# EasyEDA schematic Task10.1PCB.json
TITLE: Sheet_1; REV: 1.0; Date: 2020-06-05; Sheet: 1/1; Drawn By: smhamza; Company: Your Company
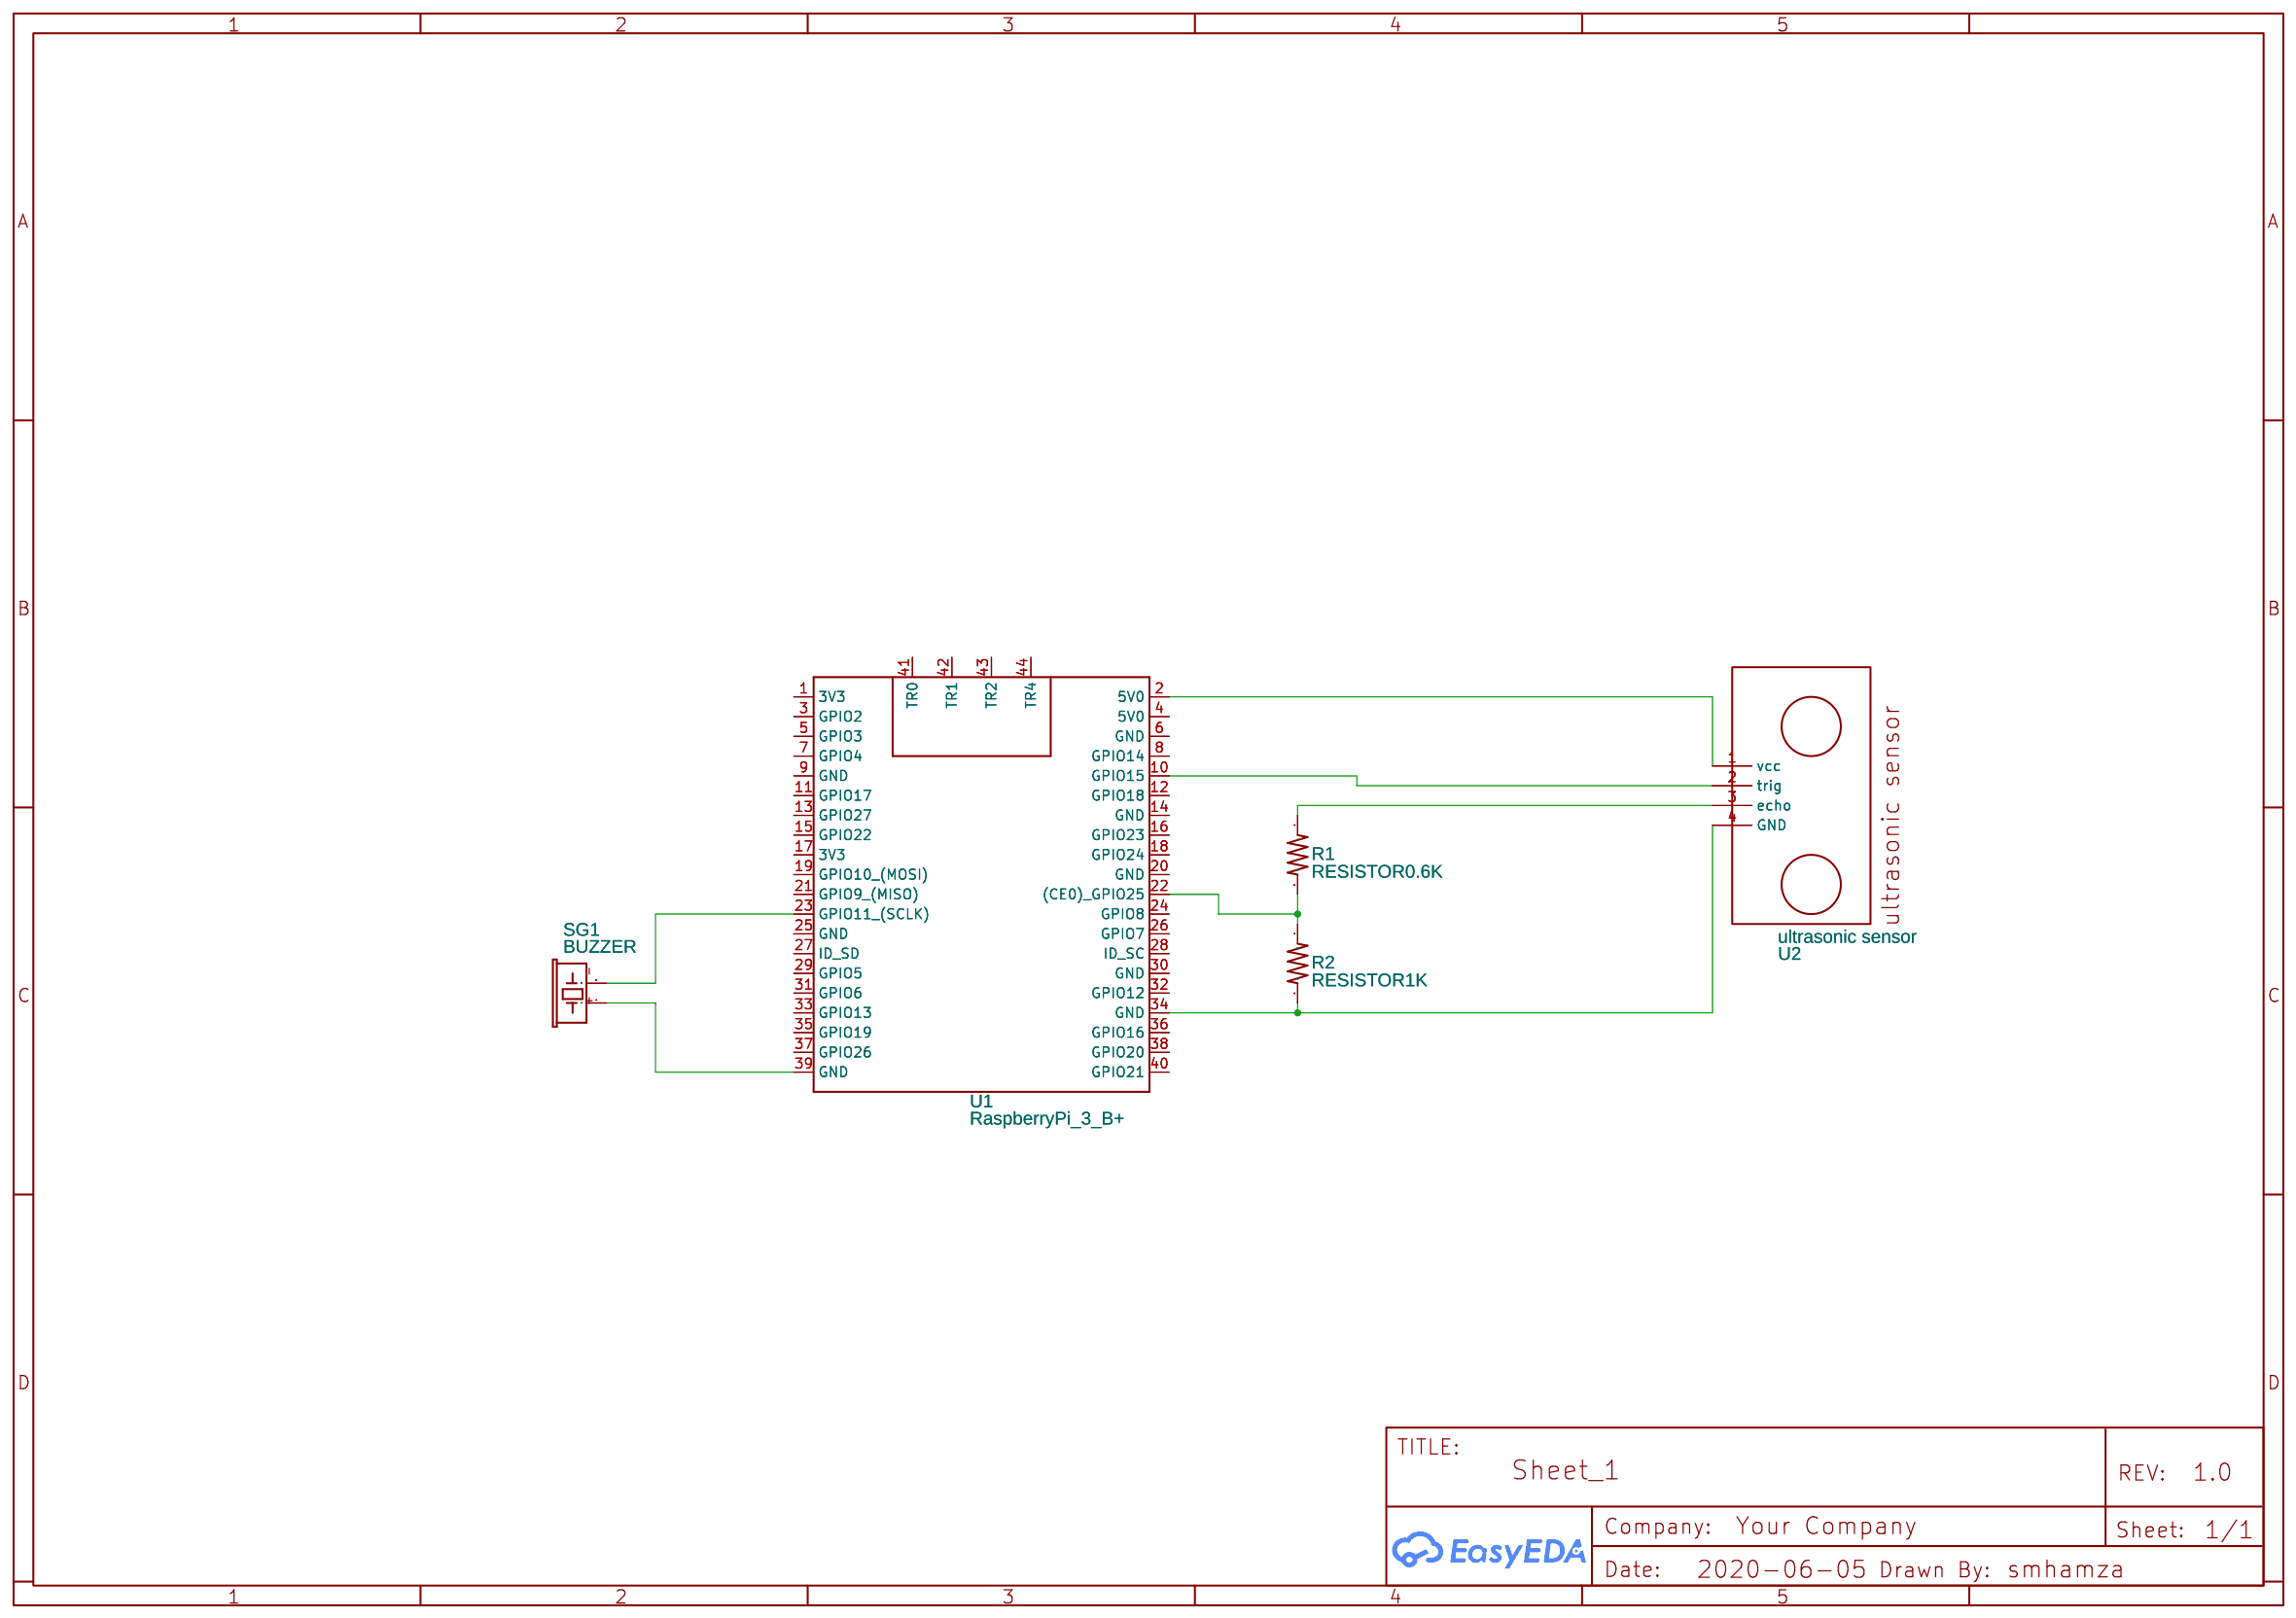
[diagram p0: schematic sheet]

## Parts
R1  RESISTOR0.6K  [VISH-RES-0603]
R2  RESISTOR1K  [VISH-RES-0603]
SG1  BUZZER  [BUZZER-HOFFMANN]
U1  RaspberryPi_3_B+  [RASBERRYPI_3_B+_POE]
U2  ultrasonic sensor  [ULTRASONIC SENSOR]

## Library data of the parts
R1 R2 = RESISTOR1K: Contributor: Time God
SG1 = BUZZER: Contributor: SparkFun
U1 = RaspberryPi_3_B+: Manufacturer Part: RaspberryPi 3; Contributor: sebasiano
U2 = ultrasonic sensor: Supplier: LCSC; Contributor: Aksen

## Nets
Net-(R1-1): R1.1 U2.3(echo)
Net-(R1-2): R1.2 R2.1 U1.22((CE0) GPIO25)
Net-(R2-2): R2.2 U1.34(GND) U2.4(GND)
Net-(SG1-1): SG1.1 U1.39(GND)
Net-(SG1-2): SG1.2 U1.23(GPIO11 (SCLK))
Net-(U1-2): U1.2(5V0) U2.1(vcc)
Net-(U1-10): U1.10(GPIO15) U2.2(trig)

Not connected (* = marked no-connect by the designer): U1 1(3V3) 3(GPIO2) 4(5V0) 5(GPIO3) 6(GND) 7(GPIO4) 8(GPIO14) 9(GND) 11(GPIO17) 12(GPIO18) 13(GPIO27) 14(GND) 15(GPIO22) 16(GPIO23) 17(3V3) 18(GPIO24) 19(GPIO10 (MOSI)) 20(GND) 21(GPIO9 (MISO)) 24(GPIO8) 25(GND) 26(GPIO7) 27(ID_SD) 28(ID_SC) 29(GPIO5) 30(GND) 31(GPIO6) 32(GPIO12) 33(GPIO13) 35(GPIO19) 36(GPIO16) 37(GPIO26) 38(GPIO20) 40(GPIO21) 41(TR0) 42(TR1) 43(TR2) 44(TR4)
